# EAGLE design gondola (EAGLE 7.5.0)
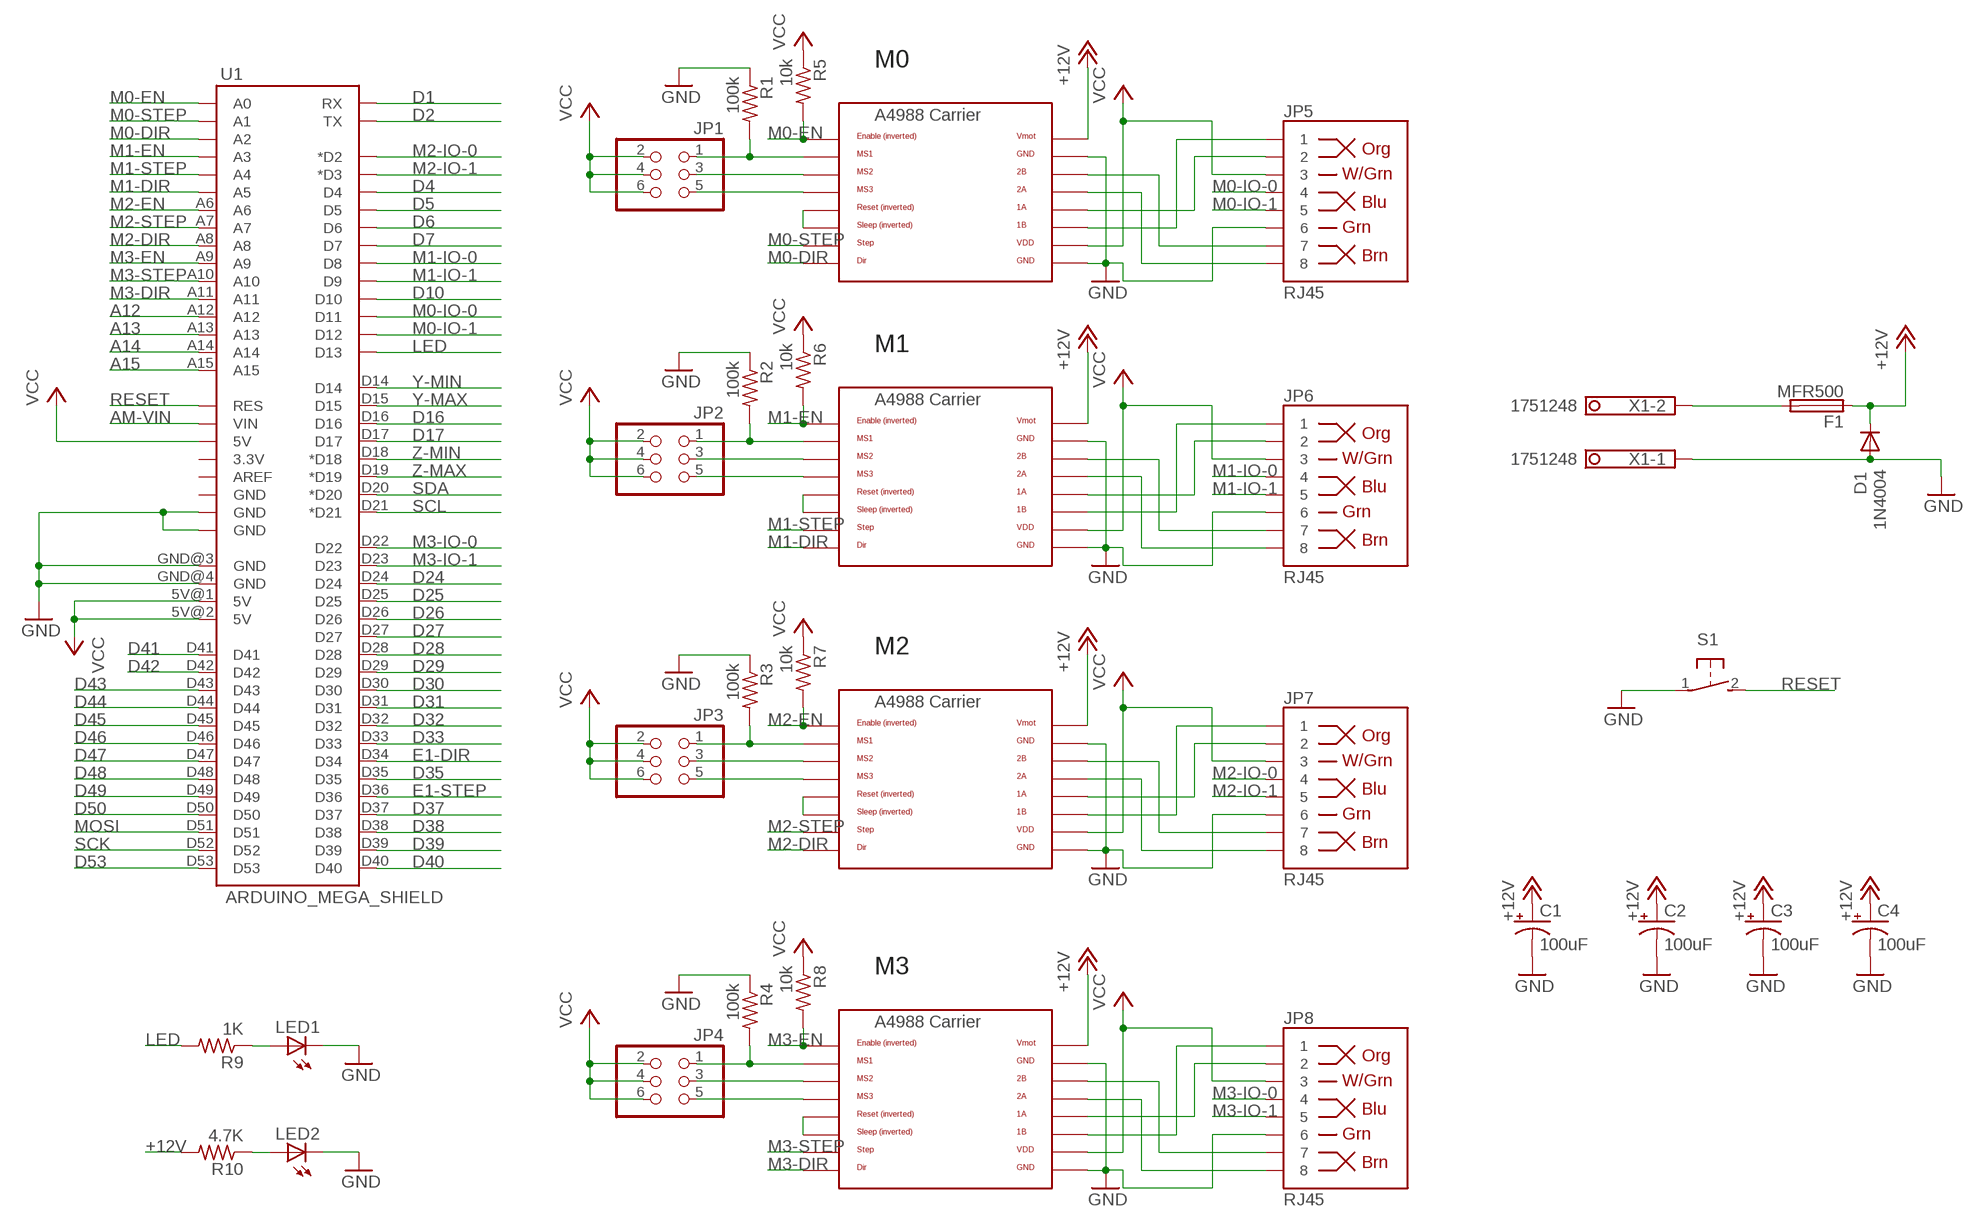
[diagram p0: schematic, sheet 1]

## Parts
C1  100uF  CPOL-US153CLV-0605  [153CLV-0605]
C2  100uF  CPOL-US153CLV-0605  [153CLV-0605]
C3  100uF  CPOL-US153CLV-0605  [153CLV-0605]
C4  100uF  CPOL-US153CLV-0605  [153CLV-0605]
D1  1N4004  [DO41-10]
F1  MFR500  PTCFUSE  [MFR500]
JP1  PINHD-2X3  [2X03]
JP2  PINHD-2X3  [2X03]
JP3  PINHD-2X3  [2X03]
JP4  PINHD-2X3  [2X03]
JP5  RJ45  RJ45-8PTH  [RJ45-8]
JP6  RJ45  RJ45-8PTH  [RJ45-8]
JP7  RJ45  RJ45-8PTH  [RJ45-8]
JP8  RJ45  RJ45-8PTH  [RJ45-8]
LED1  LEDCHIP-LED0805  [CHIP-LED0805]
LED2  LEDCHIP-LED0805  [CHIP-LED0805]
R1  100k  R-US_R0805  [R0805]
R2  100k  R-US_R0805  [R0805]
R3  100k  R-US_R0805  [R0805]
R4  100k  R-US_R0805  [R0805]
R5  10k  R-US_R0805  [R0805]
R6  10k  R-US_R0805  [R0805]
R7  10k  R-US_R0805  [R0805]
R8  10k  R-US_R0805  [R0805]
R9  1K  R-US_R0805  [R0805]
R10  4.7K  R-US_R0805  [R0805]
S1  31-XX  [B3F-31XX]
U1  ARDUINO_MEGA_SHIELD  [ARDUINO_MEGA_SHIELD]
U$1  A4988BREAKOUT  [A4988BREAKOUT]
U$2  A4988BREAKOUT  [A4988BREAKOUT]
U$3  A4988BREAKOUT  [A4988BREAKOUT]
U$4  A4988BREAKOUT  [A4988BREAKOUT]
X1  1751248  [1751248]

## Nets
+12V: C1.+ C2.+ C3.+ C4.+ D1.C F1.1 R10.2 U$1.VMOT U$2.VMOT U$3.VMOT U$4.VMOT
A12: U1.A12
A13: U1.A13
A14: U1.A14
A15: U1.A15
AM-VIN: U1.VIN
D1: U1.RX
D2: U1.TX
D4: U1.D4
D5: U1.D5
D6: U1.D6
D7: U1.D7
D10: U1.D10
D16: U1.D16
D17: U1.D17
D24: U1.D24
D25: U1.D25
D26: U1.D26
D27: U1.D27
D28: U1.D28
D29: U1.D29
D30: U1.D30
D31: U1.D31
D32: U1.D32
D33: U1.D33
D35: U1.D35
D37: U1.D37
D38: U1.D38
D39: U1.D39
D40: U1.D40
D41: U1.D41
D42: U1.D42
D43: U1.D43
D44: U1.D44
D45: U1.D45
D46: U1.D46
D47: U1.D47
D48: U1.D48
D49: U1.D49
D50: U1.D50
D53: U1.D53
E1-DIR: U1.D34
E1-STEP: U1.D36
GND: C1.- C2.- C3.- C4.- D1.A JP5.6 JP6.6 JP7.6 JP8.6 LED1.C LED2.C R1.1 R2.1 R3.1 R4.1 S1.1(P) U1.GND@0(GND) U1.GND@1(GND) U1.GND@3(GND) U1.GND@4(GND) U$1.GND U$1.GND@0(GND) U$2.GND U$2.GND@0(GND) U$3.GND U$3.GND@0(GND) U$4.GND U$4.GND@0(GND) X1.1
LED: R9.2 U1.D13
M0-DIR: U1.A2 U$4.DIR
M0-EN: R5.2 U1.A0 U$4.EN
M0-IO-0: JP5.4 U1.D11
M0-IO-1: JP5.5 U1.D12
M0-STEP: U1.A1 U$4.STEP
M1-DIR: U1.A5 U$1.DIR
M1-EN: R6.2 U1.A3 U$1.EN
M1-IO-0: JP6.4 U1.D8
M1-IO-1: JP6.5 U1.D9
M1-STEP: U1.A4 U$1.STEP
M2-DIR: U1.A8 U$2.DIR
M2-EN: R7.2 U1.A6 U$2.EN
M2-IO-0: JP7.4 U1.D2(*D2)
M2-IO-1: JP7.5 U1.D3(*D3)
M2-STEP: U1.A7 U$2.STEP
M3-DIR: U1.A11 U$3.DIR
M3-EN: R8.2 U1.A9 U$3.EN
M3-IO-0: JP8.4 U1.D22
M3-IO-1: JP8.5 U1.D23
M3-STEP: U1.A10 U$3.STEP
MOSI: U1.D51
N$1: JP2.5 U$1.MS3
N$2: U$1.RST U$1.SLP(SLEEP)
N$3: JP1.5 U$4.MS3
N$4: U$4.RST U$4.SLP(SLEEP)
N$5: JP1.1 R1.2 U$4.MS1
N$6: JP1.3 U$4.MS2
N$7: JP2.1 R2.2 U$1.MS1
N$8: JP6.7 U$1.2B
N$9: JP6.8 U$1.2A
N$10: JP6.1 U$1.1B
N$11: JP6.2 U$1.1A
N$12: JP2.3 U$1.MS2
N$13: JP5.7 U$4.2B
N$14: JP5.8 U$4.2A
N$15: JP5.1 U$4.1B
N$16: JP5.2 U$4.1A
N$17: JP3.5 U$2.MS3
N$18: U$2.RST U$2.SLP(SLEEP)
N$19: JP3.1 R3.2 U$2.MS1
N$20: JP3.3 U$2.MS2
N$21: JP7.7 U$2.2B
N$22: JP7.8 U$2.2A
N$23: JP7.1 U$2.1B
N$24: JP7.2 U$2.1A
N$25: JP4.5 U$3.MS3
N$26: U$3.RST U$3.SLP(SLEEP)
N$27: JP4.1 R4.2 U$3.MS1
N$28: JP4.3 U$3.MS2
N$29: JP8.7 U$3.2B
N$30: JP8.8 U$3.2A
N$31: JP8.2 U$3.1A
N$32: JP8.1 U$3.1B
N$33: LED2.A R10.1
N$46: LED1.A R9.1
N$54: F1.2 X1.2
RESET: S1.2(S) U1.RES
SCK: U1.D52
SCL: U1.D21(*D21)
SDA: U1.D20(*D20)
VCC: JP1.2 JP1.4 JP1.6 JP2.2 JP2.4 JP2.6 JP3.2 JP3.4 JP3.6 JP4.2 JP4.4 JP4.6 JP5.3 JP6.3 JP7.3 JP8.3 R5.1 R6.1 R7.1 R8.1 U1.5V@0(5V) U1.5V@1(5V) U1.5V@2(5V) U$1.VDD U$2.VDD U$3.VDD U$4.VDD
Y-MAX: U1.D15
Y-MIN: U1.D14
Z-MAX: U1.D19(*D19)
Z-MIN: U1.D18(*D18)
Unconnected: U1.3.3V U1.AREF U1.GND@2(GND)

## Notes on the sheet
- M0
- M1
- M2
- M3

## Library data of the parts
C1-C4 = adafruit:CPOL-US: POLARIZED CAPACITOR, American symbol
D1 = diode:1N4004: DIODE general purpose rectifier, 1 A
F1 = RepRapjr:PTCFUSE: LITTLEFUSE Picofuse/slow Littlefuse
JP1-JP4 = pinhead:PINHD-2X3: PIN HEADER
JP5-JP8 = SparkFun-Connectors:RJ45-8: RJ45 Jack Simple RJ45, 8-pin connection - connector for common Cat5, Cat5e, and Cat6 Ethernet cables. Footprint not yet proven in production. Connector sku is PRT-00643; Breakout PCB sku is BOB-00716.; PROD_ID: CONN-08506
LED1 LED2 = led:LED: LED OSRAM: - CHIPLED LG R971, LG N971, LY N971, LG Q971, LY Q971, LO R971, LY R971 LH N974, LH R974 LS Q976, LO Q976, LY Q976 LO Q996 - Hyper CHIPLED LW Q18S LB Q993, LB Q99A, LB R99A - SideLED LS A670, LO A670, LY A670, LG A670, LP A670 LB A673, LV A673, LT A673, LW A673 LH A674 LY A675 LS A676, LA A676, LO A676, LY A676, LW A676 LS A679, LY A679, LG A679 - Hyper Micro SIDELED® LS Y876, LA Y876, LO Y876, LY Y876 LT Y87S - SmartLED LW L88C, LW L88S LB L89C, LB L89S, LG L890 LS L89K, LO L89K, LY L89K LS L896, LA L896, LO L896, LY L896 - TOPLED LS T670, LO T670, LY T670, LG T670, LP T670 LSG T670, LSP T670, LSY T670, LOP T670, LYG T670 LG T671, LOG T671, LSG T671 LB T673, LV T673, LT T673, LW T673 LH T674 LS T676, LA T676, LO T676, LY T676, LB T676, LH T676, LSB T676, LW T676 LB T67C, LV T67C, LT T67C, LS T67K, LO T67K, LY T67K, LW E67C LS E67B, LA E67B, LO E67B, LY E67B, LB E67C, LV E67C, LT E67C LW T67C LS T679, LY T679, LG T679 LS T770, LO T770, LY T770, LG T770, LP T770 LB T773, LV T773, LT T773, LW T773 LH T774 LS E675, LA E675, LY E675, LS T675 LS T776, LA T776, LO T776, LY T776, LB T776 LHGB T686 LT T68C, LB T68C - Hyper Mini TOPLED® LB M676 - Mini TOPLED Santana® LG M470 LS M47K, LO M47K, LY M47K Source: http://www.osram.convergy.de LUXEON: - LUMILED® LXK2-PW12-R00, LXK2-PW12-S00, LXK2-PW14-U00, LXK2-PW14-V00 LXK2-PM12-R00, LXK2-PM12-S00, LXK2-PM14-U00 LXK2-PE12-Q00, LXK2-PE12-R00, LXK2-PE12-S00, LXK2-PE14-T00, LXK2-PE14-U00 LXK2-PB12-K00, LXK2-PB12-L00, LXK2-PB12-M00, LXK2-PB14-N00, LXK2-PB14-P00, LXK2-PB14-Q00 LXK2-PR12-L00, LXK2-PR12-M00, LXK2-PR14-Q00, LXK2-PR14-R00 LXK2-PD12-Q00, LXK2-PD12-R00, LXK2-PD12-S00 LXK2-PH12-R00, LXK2-PH12-S00 LXK2-PL12-P00, LXK2-PL12-Q00, LXK2-PL12-R00 Source: www.luxeon.com KINGBRIGHT: KA-3528ASYC Source: www.kingbright.com
R1-R10 = adafruit:R-US_: RESISTOR, American symbol
S1 = switch-omron:31-XX: OMRON SWITCH; MPN: B3F-3100; OC_FARNELL: 959704; OC_NEWARK: 36M3582
U1 = RepRapjr:ARDUINO_MEGA_SHIELD
U$1-U$4 = RepRapjr:A4988BREAKOUT
X1 = con-phoenix-350:1751248: MKDS 1/ 2-3,5 Printklemme Nennstrom: 10 A Bemessungsspannung: 160 V Raster: 3,5 mm Polzahl: 2 Montageart: Löten Anschlussart: Schraubanschluss Anschlussrichtung vom Leiter zur Platine: 0° Source: http://eshop.phoenixcontact.com .. 1751248.pdf; OC_FARNELL: unknown; OC_NEWARK: unknown

## Board
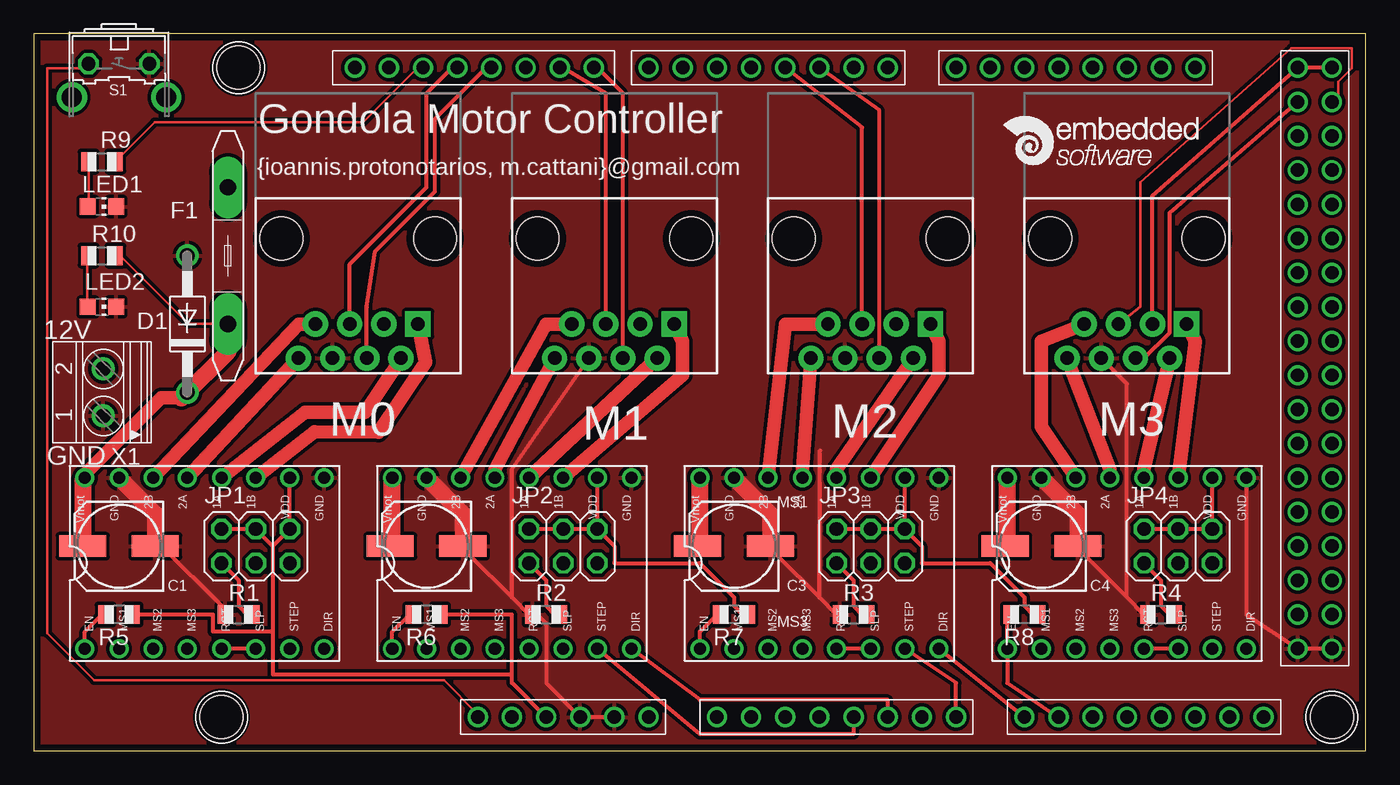
[diagram p1: board, top side]
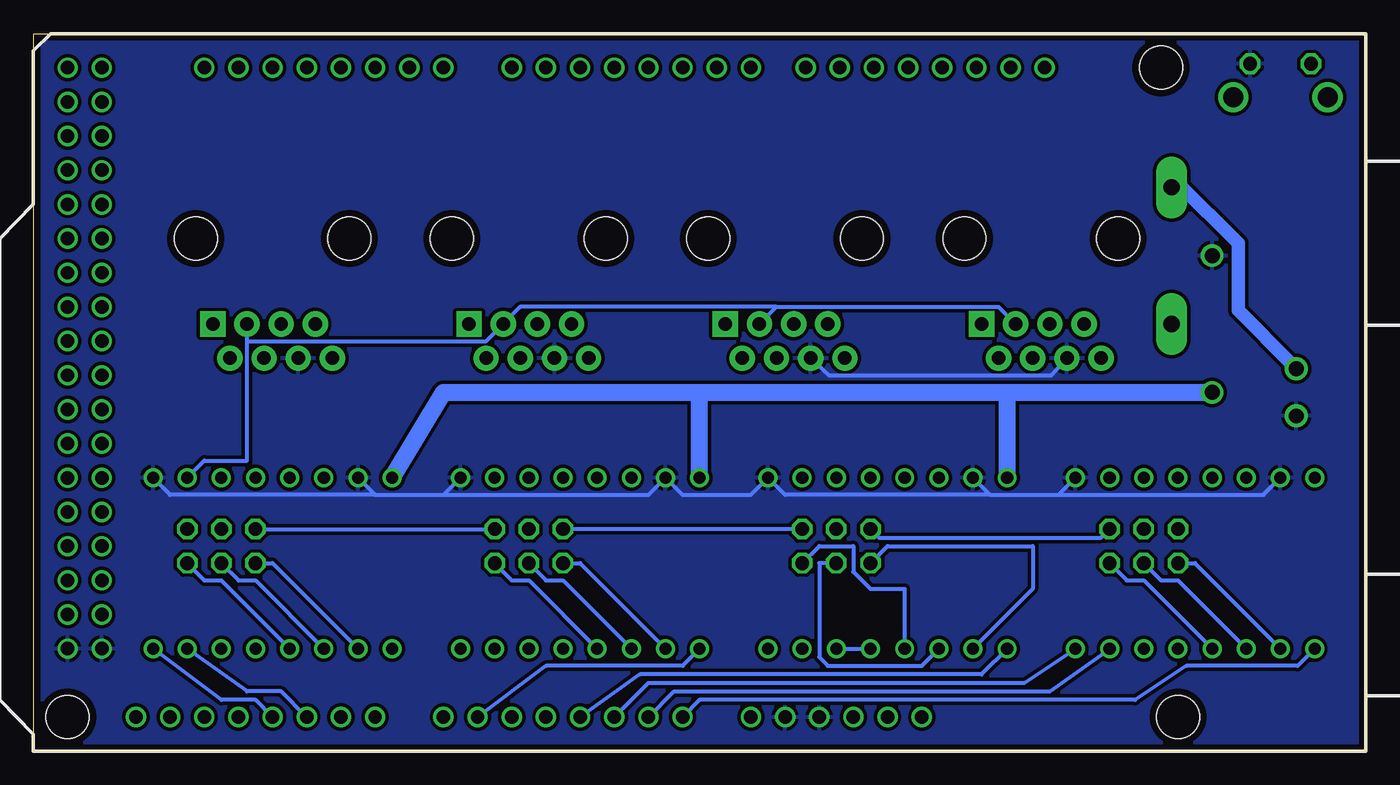
[diagram p2: board, bottom side, seen from below]

Size 99.05 x 53.33 mm. Coordinates in mm from the lower left corner, seen from the top.
Outline: 99.05,0 99.05,53.33 0,53.33 0,0 99.05,0
Copper layers (1*16): Top 0.035mm / dielectric 1.5mm / Bottom 0.035mm
Design rules "ShenZhen2U EagleRules": minimum track width 7mil, minimum drill 12mil, track to track 7mil, track to pad 7mil, pad to pad 7mil, via to via 7mil, smd to smd 0mil, copper to edge 20mil, drill to drill 10mil, minimum pad ring 10mil, minimum via ring 6mil, stop-mask expansion 2mil, vias tented up to drill 25mil, thermal gap 10mil

### Footprints (pad centres in the part's own frame; a part is rotated, then mirrored left to right if it is on the bottom)
153CLV-0605 = smd 3.5 x 1.6: + 2.7,0; - -2.7,0
DO41-10 = drill 1.118: A 5.08,0; C -5.08,0
MFR500 = drill 1.2 pad 2.3 long: 1 -5.08,0; 2 5.08,0
2X03 = drill 1.016 octagon: 1 -2.54,-1.27; 2 -2.54,1.27; 3 0,-1.27; 4 0,1.27; 5 2.54,-1.27; 6 2.54,1.27
RJ45-8 = drill 1 pad 1.88 square: 1 -4.445,6.35 | drill 1 pad 1.88: 2 -3.175,8.89; 3 -1.905,6.35; 4 -0.635,8.89; 5 0.635,6.35; 6 1.905,8.89; 7 3.175,6.35; 8 4.445,8.89 | hole 3.2: -5.715,0; 5.715,0
CHIP-LED0805 = smd 1.2 x 1.2: A 0,-1.05; C 0,1.05
R0805 = smd 1.1 x 1.4: 1 -1,0; 2 1,0
B3F-31XX = drill 1.016 octagon: 1 -2.261,-1.245; 2 2.261,-1.245 | drill 1.499 pad 2.159: 3 -3.505,1.245; 4 3.505,1.245
ARDUINO_MEGA_SHIELD = drill 1 pad 1.422: 3.3V 35.56,2.54; 5V@0 38.1,2.54; 5V@1 93.98,50.8; 5V@2 96.52,50.8; A0 50.8,2.54; A1 53.34,2.54; A2 55.88,2.54; A3 58.42,2.54; A4 60.96,2.54; A5 63.5,2.54; A6 66.04,2.54; A7 68.58,2.54; A8 73.66,2.54; A9 76.2,2.54; A10 78.74,2.54; A11 81.28,2.54; A12 83.82,2.54; A13 86.36,2.54; A14 88.9,2.54; A15 91.44,2.54; AREF 23.876,50.8; D2 58.42,50.8; D3 55.88,50.8; D4 53.34,50.8; D5 50.8,50.8; D6 48.26,50.8; D7 45.72,50.8; D8 41.656,50.8; D9 39.116,50.8; D10 36.576,50.8; D11 34.036,50.8; D12 31.496,50.8; D13 28.956,50.8; D14 68.58,50.8; D15 71.12,50.8; D16 73.66,50.8; D17 76.2,50.8; D18 78.74,50.8; D19 81.28,50.8; D20 83.82,50.8; D21 86.36,50.8; D22 93.98,48.26; D23 96.52,48.26; D24 93.98,45.72; D25 96.52,45.72; D26 93.98,43.18; D27 96.52,43.18; D28 93.98,40.64; D29 96.52,40.64; D30 93.98,38.1; D31 96.52,38.1; D32 93.98,35.56; D33 96.52,35.56; D34 93.98,33.02; D35 96.52,33.02; D36 93.98,30.48; D37 96.52,30.48; D38 93.98,27.94; D39 96.52,27.94; D40 93.98,25.4; D41 96.52,25.4; D42 93.98,22.86; D43 96.52,22.86; D44 93.98,20.32; D45 96.52,20.32; D46 93.98,17.78; D47 96.52,17.78; D48 93.98,15.24; D49 96.52,15.24; D50 93.98,12.7; D51 96.52,12.7; D52 93.98,10.16; D53 96.52,10.16; GND@0 40.64,2.54; GND@1 43.18,2.54; GND@2 26.416,50.8; GND@3 93.98,7.62; GND@4 96.52,7.62; RES 33.02,2.54; RX 63.5,50.8; TX 60.96,50.8; VIN 45.72,2.54 | hole 3.2: 96.52,2.54; 13.97,2.54; 15.24,50.8
A4988BREAKOUT = drill 0.9: 1A 8.89,1.27; 1B 11.43,1.27; 2A 6.35,1.27; 2B 3.81,1.27; DIR 16.51,-11.43; EN -1.27,-11.43; GND 16.51,1.27; GND@0 1.27,1.27; MS1 1.27,-11.43; MS2 3.81,-11.43; MS3 6.35,-11.43; RST 8.89,-11.43; SLP 11.43,-11.43; STEP 13.97,-11.43; VDD 13.97,1.27; VMOT -1.27,1.27
1751248 = drill 1.1 pad 1.7: 1 -1.75,-0.1; 2 1.75,-0.1

### Placement (x,y rotation side)
C1  6.35,15.24 180 top
C2  29.21,15.24 180 top
C3  52.07,15.24 180 top
C4  74.93,15.24 180 top
D1  11.43,31.75 90 top
F1  14.45,36.83 90 top
JP1  16.51,15.24 0 top
JP2  39.37,15.24 0 top
JP3  62.23,15.24 0 top
JP4  85.09,15.24 0 top
JP5  24.13,38.1 180 top
JP6  43.18,38.1 180 top
JP7  62.23,38.1 180 top
JP8  81.28,38.1 180 top
LED1  5.08,40.48 270 top
LED2  5.08,33.02 270 top
R1  15.24,10.16 0 top
R2  38.1,10.16 0 top
R3  60.96,10.16 0 top
R4  83.82,10.16 0 top
R5  6.35,10.16 180 top
R6  29.21,10.16 180 top
R7  52.07,10.16 180 top
R8  73.66,10.16 180 top
R9  5.08,43.81 0 top
R10  5.08,36.83 0 top
S1  6.35,49.85 180 top
U1  0,0 0 top
U$1  27.94,19.05 0 top
U$2  50.8,19.05 0 top
U$3  73.66,19.05 0 top
U$4  5.08,19.05 0 top
X1  5.08,26.67 90 top

### Tracks (layer width: path | path; a pad name or v marks a point on that pad's centre or on a via)
+12V
  Top 0.178: 4,20.76 U$4.VMOT | R10.2 6.5,36.76 11.5,31.76 14,31.76 F1.1
  Top 0.406: 11,26.26 11.41,26.67 D1.C
  Top 1.016: 4,20.76 9.5,26.26 11,26.26
  Top 1.27: U$4.VMOT 3.65,20.16 C1.+ | C3.+ 49.53,15.4 U$2.VMOT | C4.+ 72.39,15.4 U$3.VMOT | C2.+ 26.67,15.4 U$1.VMOT | 11,26.26 14.45,29.71 F1.1
  Bottom 1.27: U$3.VMOT 68.58,26.67 49.53,26.67 | 49.53,26.67 26.67,26.67 | 26.67,26.67 D1.C | U$2.VMOT 49.53,26.67 | U$1.VMOT 26.67,26.67
GND
  Top 0.305: 58.42,11.43 55.24,14.6 55.24,15.24 C3.- | 58.42,11.43 59.69,10.16 R3.1 | 58.42,11.43 58.47,22.35 | U1.GND@4 U1.GND@3 90.17,10.16 U$3.GND | 81.28,11.43 78.11,14.6 78.11,15.24 C4.- | 81.28,11.43 82.55,10.16 R4.1 | JP8.6 81.28,27.3 81.28,11.43 | R1.1 13.97,10.16 13.97,10.79 9.53,15.24 C1.- | U1.GND@1 U1.GND@0 38.1,5.08 38.1,9.53 37.47,10.16 R2.1 36.83,10.16 35.56,11.43 | 35.56,11.43 32.38,14.6 32.38,15.24 C2.- | JP6.6 35.56,20.95 35.56,11.43
  Top 1.27: U$4.GND@0 9.05,17.62 C1.- | U$1.GND@0 31.91,17.62 C2.- | U$2.GND@0 54.77,17.62 C3.- | U$3.GND@0 77.63,17.62 C4.-
  Bottom 0.305: 68.58,19.05 U$2.GND | 73.66,19.05 68.58,19.05 | U$3.GND@0 73.66,19.05 | U$3.GND 88.9,19.05 73.66,19.05 | 68.58,19.05 53.34,19.05 U$2.GND@0 50.8,19.05 45.72,19.05 U$1.GND 43.18,19.05 27.94,19.05 | JP5.6 23.39,27.94 39.9,27.94 JP6.6 | 22.86,19.05 U$4.GND | 27.94,19.05 22.86,19.05 | U$1.GND@0 27.94,19.05 | U$4.GND@0 7.62,19.05 22.86,19.05
  pour Top (isolate 0.254): 0,53.34 0,0 99.06,0 99.06,53.34
  pour Bottom (isolate 0.254): 0,53.34 99.06,53.34 99.06,0 0,0
LED
  Top 0.178: R9.2 6.5,44.26 9,46.76 24.5,46.76 28.5,50.76 U1.D13
M0-DIR
  Bottom 0.305: U$4.DIR 25.4,5.08 53.34,5.08 U1.A2
M0-EN
  Top 0.305: U$4.EN 3.81,8.89 5.08,10.16 R5.2
  Bottom 0.305: U1.A0 49.53,3.81 17.14,3.81 13.34,6.35 5.08,6.35 U$4.EN
M0-IO-0
  Top 0.305: JP5.4 24.77,33.02 25.4,37.16 29.84,41.6 29.84,46.99 33.66,50.8 U1.D11
M0-IO-1
  Top 0.305: JP5.5 23.5,36.2 29.21,41.91 29.21,48.9 31.11,50.8 U1.D12
M0-STEP
  Bottom 0.305: U$4.STEP 23.5,4.44 51.44,4.44 U1.A1
M1-DIR
  Top 0.305: U$1.DIR 49.53,3.81 63.5,3.81 U1.A5
M1-EN
  Top 0.305: U$1.EN 26.67,8.89 27.94,10.16 R6.2
  Bottom 0.305: U1.A3 53.98,5.71 28.57,5.71 U$1.EN
M1-IO-0
  Top 0.305: JP6.4 43.81,48.9 41.91,50.8 U1.D8
M1-IO-1
  Top 0.305: JP6.5 42.55,48.9 39.37,50.8 U1.D9
M1-STEP
  Top 0.305: U$1.STEP 49.53,1.27 60.96,1.27 U1.A4
M2-DIR
  Top 0.305: U1.A8 U$2.DIR
M2-EN
  Top 0.305: U$2.EN 49.53,8.89 50.8,10.16 R7.2
  Bottom 0.305: U1.A6 60.96,6.35 50.8,6.35 U$2.EN
M2-IO-0
  Top 0.305: U1.D2 62.87,47.62 JP7.4
M2-IO-1
  Top 0.305: U1.D3 61.59,46.35 JP7.5
M2-STEP
  Top 0.305: U$2.STEP 68.58,5.08 U1.A7
M3-DIR
  Bottom 0.305: U$3.DIR 85.09,3.81 82.55,3.81 U1.A11
M3-EN
  Top 0.305: R8.2 72.39,10.16 U$3.EN 72.39,5.08 U1.A9
M3-IO-0
  Top 0.305: U1.D22 84.45,40 84.45,31.11 82.55,29.21 JP8.4
M3-IO-1
  Top 0.178: U1.D23 97,48.26 97,49.76 98,50.76 98,52.26 93.5,52.26 82.27,42.3 82.27,33.03 JP8.5
M3-STEP
  Bottom 0.305: U$3.STEP 83.19,4.44 80.64,4.44 U1.A10
N$1
  Bottom 0.305: U$1.MS3 34.29,12.06 36.83,12.06 38.1,13.33 38.1,15.24 40.64,15.24 JP2.5
N$2
  Bottom 0.305: U$1.SLP U$1.RST
N$3
  Bottom 0.305: U$4.MS3 16.51,12.7 17.78,12.7 JP1.5
N$4
  Top 0.305: U$4.SLP U$4.RST
N$5
  Top 0.305: JP1.1 15.24,12.7 15.24,10.79 15.88,10.16 R1.2
  Bottom 0.305: U$4.MS1 12.7,13.97 JP1.1
N$6
  Bottom 0.305: U$4.MS2 13.97,12.7 15.24,12.7 JP1.3
N$7
  Top 0.305: JP2.1 38.1,12.7 38.1,10.79 38.73,10.16 R2.2
  Bottom 0.305: U$1.MS1 24.77,12.06 24.77,15.24 35.56,15.24 JP2.1
N$8
  Top 1.016: JP6.7 38.1,31.75 U$1.2B
N$9
  Top 1.016: JP6.8 34.29,20.95 U$1.2A
N$10
  Top 1.016: U$1.1B 48.26,27.94 48.26,30.48 JP6.1
N$11
  Top 1.016: JP6.2 U$1.1A
N$12
  Bottom 0.305: U$1.MS2 33.02,6.35 40.01,6.35 40.64,6.99 40.64,13.97 JP2.3
N$13
  Top 1.016: JP5.7 19.68,31.75 U$4.2B
N$14
  Top 1.016: U$4.2A JP5.8
N$15
  Top 1.016: U$4.1B 20.9,23.75 25.65,23.7 29.13,28.91 JP5.1
N$16
  Top 1.016: U$4.1A 20.17,25.2 24.66,25.2 27.3,29.16 JP5.2
N$17
  Bottom 0.305: U$2.MS3 62.23,12.7 63.5,12.7 JP3.5
N$18
  Top 0.305: U$2.SLP U$2.RST
N$19
  Top 0.305: JP3.1 60.96,12.7 60.96,10.79 61.59,10.16 R3.2
  Bottom 0.305: U$2.MS1 58.42,13.97 JP3.1
N$20
  Bottom 0.305: U$2.MS2 59.69,12.7 60.96,12.7 JP3.3
N$21
  Top 1.016: JP7.7 55.88,31.75 U$2.2B
N$22
  Top 1.016: JP7.8 57.15,20.95 U$2.2A
N$23
  Top 1.016: U$2.1B 67.31,27.94 67.31,30.48 JP7.1
N$24
  Top 1.016: JP7.2 59.69,20.95 U$2.1A
N$25
  Bottom 0.305: U$3.MS3 85.09,12.7 86.36,12.7 JP4.5
N$26
  Top 0.305: U$3.SLP U$3.RST
N$27
  Top 0.305: JP4.1 83.82,12.7 83.82,10.79 84.45,10.16 R4.2
  Bottom 0.305: U$3.MS1 81.28,13.97 JP4.1
N$28
  Bottom 0.305: U$3.MS2 82.55,12.7 83.82,12.7 JP4.3
N$29
  Top 1.016: JP8.7 74.93,30.48 74.93,24.13 U$3.2B
N$30
  Top 1.016: JP8.8 80.01,20.95 U$3.2A
N$31
  Top 1.016: JP8.2 82.55,20.95 U$3.1A
N$32
  Top 1.016: U$3.1B 86.36,30.48 JP8.1
N$33
  Top 0.178: LED2.A 4,33.26 4,36.76 R10.1
N$46
  Top 0.178: 4.08,40.53 R9.1
  Top 0.406: LED1.A 4.08,40.53
N$54
  Bottom 0.178: 5.5,28.76 X1.2 | 14,42.26 F1.2
  Bottom 1.016: 5.5,28.76 9.5,32.76 9.5,37.76 14,42.26
RESET
  Top 0.178: U1.RES 33,2.76 30.5,5.26 4.5,5.26 1,8.76 1,50.76 4,50.76 S1.2
VCC
  Top 0.305: R6.1 35.56,10.16 35.56,5.71 | 35.56,5.71 35.56,5.08 U1.5V@0 | JP1.2 JP1.4 17.78,15.24 | R5.1 13.34,10.16 13.34,8.89 17.78,8.89 | 17.78,15.24 17.78,8.89 | 17.78,15.24 JP1.6 U$4.VDD | 35.56,5.71 17.78,5.71 17.78,8.89 | JP3.2 JP3.4 JP3.6 | JP3.6 66.04,15.24 66.04,13.97 71.12,13.97 73.66,11.43 73.66,10.79 74.3,10.16 R8.1 | JP3.6 U$2.VDD | JP2.2 JP2.4 JP2.6 | JP2.6 43.18,15.24 43.18,13.97 49.53,13.97 52.07,11.43 52.07,10.79 52.7,10.16 R7.1 | JP2.6 U$1.VDD | JP4.2 JP4.4 JP4.6 U$3.VDD | U1.5V@2 U1.5V@1 83.19,41.27 JP8.3
  Bottom 0.305: JP2.6 JP3.2 | JP5.3 27.3,33.02 43.81,33.02 | JP6.3 43.81,33.02 | 43.81,33.02 62.87,33.02 JP7.3 65.41,30.48 83.19,30.48 | 83.19,30.48 83.19,21.59 86.36,21.59 U$3.VDD | 83.19,30.48 JP8.3 | JP4.2 JP3.6 | JP1.6 19.68,15.87 36.2,15.87 JP2.2

### Text on the board
tPlace: Gondola Motor Controller | /home/user/Downloads/eS_logo.bmp | {ioannis.protonotarios, m.cattani}@gmail.com | 12V | M0 | M2 | M3 | M1 | GND
tNames: MS1 | MS3